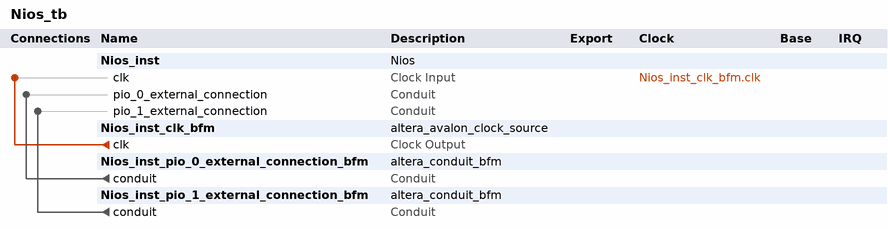
[diagram p0: system contents]
# Platform Designer (Qsys) system Nios_tb, Cyclone II EP2C35F672C6
# Parameters at their usual value, and those the tool derives, are not listed.
package require -exact qsys 13.0
create_system Nios_tb
set_project_property DEVICE_FAMILY {Cyclone II}
set_project_property DEVICE EP2C35F672C6

add_instance Nios_inst Nios 1.0

add_instance Nios_inst_clk_bfm altera_avalon_clock_source 13.0

add_instance Nios_inst_pio_0_external_connection_bfm altera_conduit_bfm 13.0
set_instance_parameter_value Nios_inst_pio_0_external_connection_bfm CLOCKED_SIGNAL false
set_instance_parameter_value Nios_inst_pio_0_external_connection_bfm ENABLE_RESET false
set_instance_parameter_value Nios_inst_pio_0_external_connection_bfm SIGNAL_WIDTHS 3
set_instance_parameter_value Nios_inst_pio_0_external_connection_bfm SIGNAL_DIRECTIONS output

add_instance Nios_inst_pio_1_external_connection_bfm altera_conduit_bfm 13.0
set_instance_parameter_value Nios_inst_pio_1_external_connection_bfm CLOCKED_SIGNAL false
set_instance_parameter_value Nios_inst_pio_1_external_connection_bfm ENABLE_RESET false
set_instance_parameter_value Nios_inst_pio_1_external_connection_bfm SIGNAL_WIDTHS 3
set_instance_parameter_value Nios_inst_pio_1_external_connection_bfm SIGNAL_DIRECTIONS input

# connections
add_connection Nios_inst_clk_bfm.clk Nios_inst.clk clock
add_connection Nios_inst_pio_0_external_connection_bfm.conduit Nios_inst.pio_0_external_connection conduit
add_connection Nios_inst_pio_1_external_connection_bfm.conduit Nios_inst.pio_1_external_connection conduit

set_interconnect_requirement {$system} qsys_mm.clockCrossingAdapter HANDSHAKE
set_interconnect_requirement {$system} qsys_mm.maxAdditionalLatency 1

save_system Nios_tb.qsys
